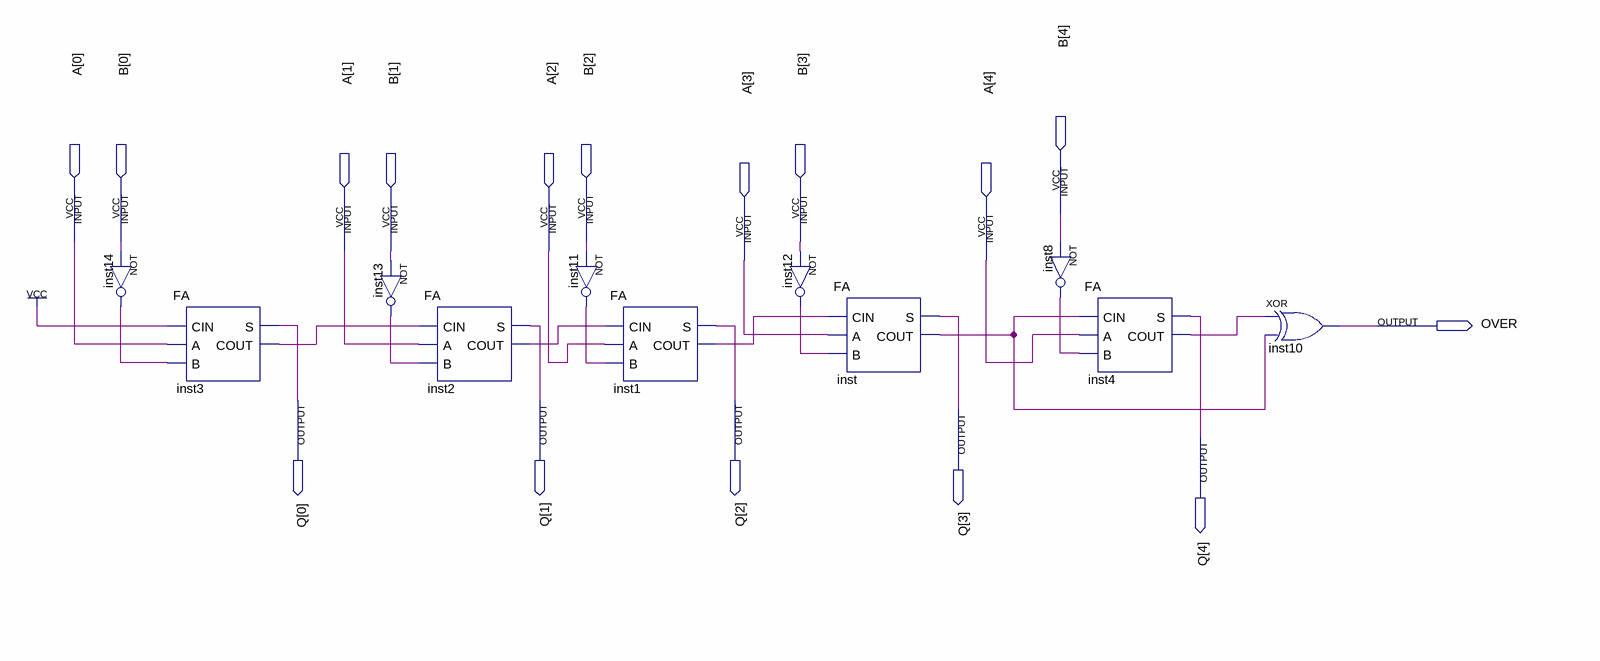
[diagram p0: schematic sheet]
// Quartus schematic SUB_4BIT.bdf as structural Verilog: 11 symbols, 16 pins
module SUB_4BIT (
  input  [4:0] B,
  input  [4:0] A,
  output OVER,
  output [4:0] Q
);

  wire inst1_cout, inst2_cout, inst3_cout, inst4_cout, inst8_out, inst11_out, inst12_out, inst13_out,
       inst14_out, inst_cout;

  not inst14 (inst14_out, B[0]);
  FA inst3 (.CIN(1'b1), .A(A[0]), .B(inst14_out), .S(Q[0]), .COUT(inst3_cout));
  not inst13 (inst13_out, B[1]);
  FA inst2 (.CIN(inst3_cout), .A(A[1]), .B(inst13_out), .S(Q[1]), .COUT(inst2_cout));
  not inst11 (inst11_out, B[2]);
  FA inst1 (.CIN(inst2_cout), .A(A[2]), .B(inst11_out), .S(Q[2]), .COUT(inst1_cout));
  not inst12 (inst12_out, B[3]);
  FA inst (.CIN(inst1_cout), .A(A[3]), .B(inst12_out), .S(Q[3]), .COUT(inst_cout));
  not inst8 (inst8_out, B[4]);
  FA inst4 (.CIN(inst_cout), .A(A[4]), .B(inst8_out), .S(Q[4]), .COUT(inst4_cout));
  xor inst10 (OVER, inst4_cout, inst_cout);
endmodule
